# Altium schematic sheet NAVC_Connectors.SchDoc
size A4; SheetNumber: 4; SheetTotal: 8
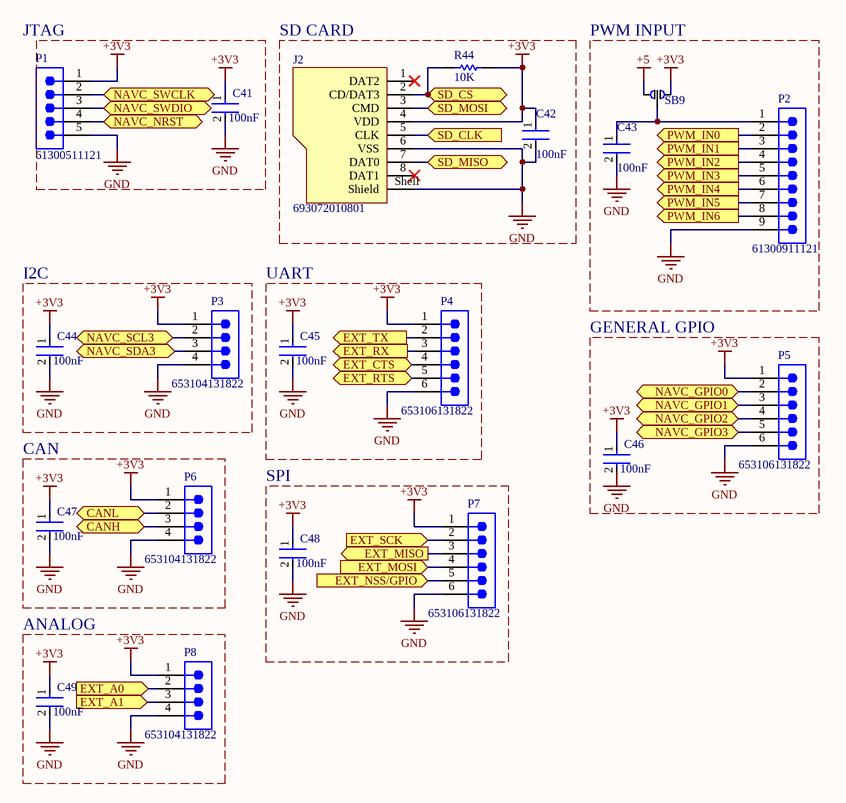
[diagram p0: NAVC_Connectors.SchDoc]

## Parts
C41  100nF  [FP-CGA3E-0_3-0_1-IPC_A]
C42  100nF  [FP-CGA3E-0_3-0_1-IPC_A]
C43  100nF  [FP-CGA3E-0_3-0_1-IPC_A]
C44  100nF  [FP-CGA3E-0_3-0_1-IPC_A]
C45  100nF  [FP-CGA3E-0_3-0_1-IPC_A]
C46  100nF  [FP-CGA3E-0_3-0_1-IPC_A]
C47  100nF  [FP-CGA3E-0_3-0_1-IPC_A]
C48  100nF  [FP-CGA3E-0_3-0_1-IPC_A]
C49  100nF  [FP-CGA3E-0_3-0_1-IPC_A]
J2  693072010801  [693072010801]
P1  61300511121  [61300511121]
P2  61300911121  [61300911121]
P3  653104131822  [653104131822]
P4  653106131822  [653106131822]
P5  653106131822  [653106131822]
P6  653104131822  [653104131822]
P7  653106131822  [653106131822]
P8  653104131822  [653104131822]
R44  10K  [RESC1608X55X25ML10T15]
SB9  Solderbridge3P  [SolderBridge3P]  (value not drawn)

## Blocks framed on the sheet
SD CARD: C42 J2 R44
PWM INPUT: C43 P2 SB9
I2C: C44 P3
UART: C45 P4
GENERAL GPIO: C46 P5
CAN: C47 P6
SPI: C48 P7
ANALOG: C49 P8

## Ports
CANH (bidir, see NAVC_Peripherals[2D]), CANL (bidir, see NAVC_Peripherals[2D]), EXT_A0 (in, see NAVC_MCU[1A]), EXT_A1 (in, see NAVC_MCU[1A]), EXT_CTS (bidir, see NAVC_MCU[2B], NAVC_MCU[2D]), EXT_MISO (out, see NAVC_MCU[1C]), EXT_MOSI (in, see NAVC_MCU[1D]), EXT_NSS/GPIO (in, see NAVC_MCU[1C]), EXT_RTS (bidir, see NAVC_MCU[2B]), EXT_RX (out, see NAVC_MCU[2A], NAVC_MCU[2D]), EXT_SCK (in, see NAVC_MCU[1C]), EXT_TX (out, see NAVC_MCU[2A], NAVC_MCU[2D]), NAVC_GPIO0 (bidir, see NAVC_MCU[2B]), NAVC_GPIO1 (bidir, see NAVC_MCU[2B]), NAVC_GPIO2 (bidir, see NAVC_MCU[2B]), NAVC_GPIO3 (bidir, see NAVC_MCU[2B]), NAVC_NRST (bidir, see NAVC_MCU[3B], NAVC_MCU[3C]), NAVC_SCL3 (bidir, see NAVC_MCU[2D], NAVC_MCU[3A]), NAVC_SDA3 (bidir, see NAVC_MCU[2D], NAVC_MCU[3A]), NAVC_SWCLK (bidir, see NAVC_MCU[1B]), NAVC_SWDIO (bidir, see NAVC_MCU[1B]), PWM_IN0 (out, see NAVC_MCU[1A]), PWM_IN1 (out, see NAVC_MCU[1A]), PWM_IN2 (out, see NAVC_MCU[1A]), PWM_IN3 (out, see NAVC_MCU[1B]), PWM_IN4 (out, see NAVC_MCU[1B]), PWM_IN5 (out, see NAVC_MCU[1B]), PWM_IN6 (out, see NAVC_MCU[1B]), SD_CLK (in, see NAVC_MCU[1A]), SD_CS (bidir, see NAVC_MCU[1A]), SD_MISO (bidir, see NAVC_MCU[1A]), SD_MOSI (bidir, see NAVC_MCU[1A])

## Nets
+3V3: C41.1 C42.1 C44.1 C45.1 C46.1 C47.1 C48.1 C49.1 J2.4(VDD) P1.1 P3.1 P4.1 P5.1 P6.1 P7.1 P8.1 R44.2 SB9.2
+5: SB9.1
GND: C41.2 C42.2 C43.2 C44.2 C45.2 C46.2 C47.2 C48.2 C49.2 J2.6(VSS) J2.Shell(Shield) P1.5 P2.9 P3.4 P4.6 P5.6 P6.4 P7.6 P8.4
CANH: P6.3 ; port CANH
CANL: P6.2 ; port CANL
EXT_A0: P8.2 ; port EXT_A0
EXT_A1: P8.3 ; port EXT_A1
EXT_CTS: P4.4 ; port EXT_CTS
EXT_MISO: P7.3 ; port EXT_MISO
EXT_MOSI: P7.4 ; port EXT_MOSI
EXT_NSS/GPIO: P7.5 ; port EXT_NSS/GPIO
EXT_RTS: P4.5 ; port EXT_RTS
EXT_RX: P4.3 ; port EXT_RX
EXT_SCK: P7.2 ; port EXT_SCK
EXT_TX: P4.2 ; port EXT_TX
NAVC_GPIO0: P5.2 ; port NAVC_GPIO0
NAVC_GPIO1: P5.3 ; port NAVC_GPIO1
NAVC_GPIO2: P5.4 ; port NAVC_GPIO2
NAVC_GPIO3: P5.5 ; port NAVC_GPIO3
NAVC_NRST: P1.4 ; port NAVC_NRST
NAVC_SCL3: P3.2 ; port NAVC_SCL3
NAVC_SDA3: P3.3 ; port NAVC_SDA3
NAVC_SWCLK: P1.2 ; port NAVC_SWCLK
NAVC_SWDIO: P1.3 ; port NAVC_SWDIO
PWM_IN0: P2.2 ; port PWM_IN0
PWM_IN1: P2.3 ; port PWM_IN1
PWM_IN2: P2.4 ; port PWM_IN2
PWM_IN3: P2.5 ; port PWM_IN3
PWM_IN4: P2.6 ; port PWM_IN4
PWM_IN5: P2.7 ; port PWM_IN5
PWM_IN6: P2.8 ; port PWM_IN6
SD_CLK: J2.5(CLK) ; port SD_CLK
SD_CS: J2.2(CD/DAT3) R44.1 ; port SD_CS
SD_MISO: J2.7(DAT0) ; port SD_MISO
SD_MOSI: J2.3(CMD) ; port SD_MOSI
NetC43_1: C43.1 P2.1 SB9.3

Not connected (* = marked no-connect by the designer): J2 1(DAT2)* 8(DAT1)*

## Notes on the sheet
- (near P1) JTAG

## Library data of the parts
C41-C49 = CMP-2000-07546-2: Cap Ceramic 100nF 50V X7R 10% Pad SMD 0603 +125°C Automotive T/R; Weight: 7.1E-05oz; Composition: Ceramic; Max Operating Temperature: 125°C; Termination: SMD/SMT; Dielectric: X7R; Length: 1.6mm; Package Quantity: 1; REACH SVHC: No SVHC; Lead Free: Lead Free; Case Code (Metric): 1608; Min Operating Temperature: -55°C; Packaging: Tape and Reel; Tolerance: 10%; Voltage Rating: 50V; Case Code (Imperial): 0603; Capacitance: 100nF; Case/Package: 0603; Voltage Rating (DC): 50V; Depth: 0.8mm; Radiation Hardening: No; Ratings: AEC-Q200; Mount: Surface Mount; Voltage: 50V; Thickness: 0.035inch; Width: 0.8mm; Height: 0.8mm
J2 = CMP-1502-00164-2: NexarPartId: 22866686; Voltage Rating: 100V; Insulation Resistance: 1GΩ; Current Rating: 500mA; Memory Type: FLASH; Number of Positions: 8; Connector Type: Connector; Width: 13.5mm; Number of Pins: 8; REACH SVHC: Unknown; Contact Material: Copper, Gold; Contact Plating: Gold; Max Operating Temperature: 85°C; Color: Black; Operating Supply Voltage: 100V; Packaging: Tape and Reel; RoHS: Compliant; Height: 1.75mm; Number of Contacts: 8; Mount: Surface Mount; Length: 14.5mm; Min Operating Temperature: -25°C
P1 = CMP-1502-01068-3: NexarPartId: 32855526; Connector Type: Male Pin; Gender: Male; Contact Resistance: 20mΩ; Pitch: 2.54mm; Operating Supply Voltage: 250V; Current Rating: 3A; Number of Contacts: 5; Lead Free: Lead Free; Color: Black; Packaging: Bulk; Lead Pitch: 2.54mm; Contact Material: Copper; Min Operating Temperature: -40°C; Contact Mating Length: 5.9944mm; Voltage Rating: 250V; Number of Pins: 5; Number of Positions: 5; Height: 8.89mm; Orientation: Vertical; REACH SVHC: Unknown; RoHS: Compliant; Contact Plating: Gold; Max Operating Temperature: 105°C; Mount: Through Hole; Number of Rows: 1; Termination: Solder
P2 = CMP-1502-01080-3: NexarPartId: 32855536; Current Rating: 3A; Connector Type: Male Pin; Operating Supply Voltage: 250V; Contact Resistance: 20mΩ; Pitch: 2.54mm; Number of Contacts: 9; Gender: Male; Lead Pitch: 2.54mm; REACH SVHC: Unknown; Number of Rows: 1; Mount: Through Hole; Contact Plating: Gold; Color: Black; Number of Pins: 9; Orientation: Vertical; Contact Material: Copper; Packaging: Bulk; Contact Mating Length: 5.9944mm; RoHS: Compliant; Number of Positions: 9; Termination: Solder
P3 P6 P8 = CMP-1502-00773-2: NexarPartId: 18818278; Contact Resistance: 20mΩ; Insulation: Insulated; Current Rating: 1A; Number of Positions: 4; Gender: Male; Insulation Resistance: 100MΩ; Pitch: 1.25mm; Operating Supply Voltage: 125V; Connector Type: Male Pin; Housing Material: Nylon; RoHS: Compliant; Number of Pins: 4; Flammability Rating: UL94 V-0; Termination: SMD/SMT; Contact Mating Length: 2.1336mm; Contact Gender: Male; Min Operating Temperature: -40°C; Packaging: Tape and Reel; Number of Contacts: 4; Color: Beige, White; Contact Plating: Tin; Max Operating Temperature: 85°C; Voltage Rating: 125V; Mount: Surface Mount; Lead Pitch: 1.25mm; Length: 9.75mm; Number of Rows: 1; Height: 4.2mm; Contact Material: Copper; Width: 9.75mm; REACH SVHC: Unknown
P4 P5 P7 = CMP-1502-00775-2: NexarPartId: 116856464; Insulation Resistance: 100MΩ; Current Rating: 1A; Gender: Male; Pitch: 1.25mm; Min Operating Temperature: -40°C; Packaging: Tape and Reel; Length: 12.25mm; Contact Plating: Tin; Max Operating Temperature: 85°C; Number of Pins: 6; RoHS: Compliant
R44 = CMP-2100-03667-1: Chip Resistor, 0 Ohm, +/- 5%, 0.1 W, -55 to 155 degC, 0603 (1608 Metric), RoHS, Tape and Reel; Manufacturer: Yageo; Temperature Coefficient: 200ppm/degreesC; Voltage Rating: 50V; Power Rating: 100mW; Resistance: 0mOhm; Width: 0.8mm; Max Operating Temperature: 155degC; Tolerance: 5%; Package Reference: 0603; Height: 0.45mm; Depth: 0.8mm; Package Description: 2-Pin Surface Mount Device, Body 1.6 x 0.8 mm; Termination: SMD/SMT; Package Quantity: 5000; Case/Package: 0603; Case Code (Imperial): 0603; Radiation Hardening: No; Number of Pins: 2; Length: 1.6mm; Lead Free: LeadFree; Voltage Rating (DC): 50V; Military Standard: Not; Datasheet URL: http://www.yageo.com/NewPortal/yageodocoutput?fileName=/pdf/R-Chip/PYu-RC_Group_51_RoHS_L_5.pdf; Manufacturer URL: http://www.yageo.com/; Packaging: TapeandReel; Case Code (Metric): 1608; Min Operating Temperature: -55degC; Composition: ThickFilm; RoHSCompliant: true; Contact Plating: Tin; Datasheet Version: Rev. 5, 10/2016; REACH SVHC: NoSVHC